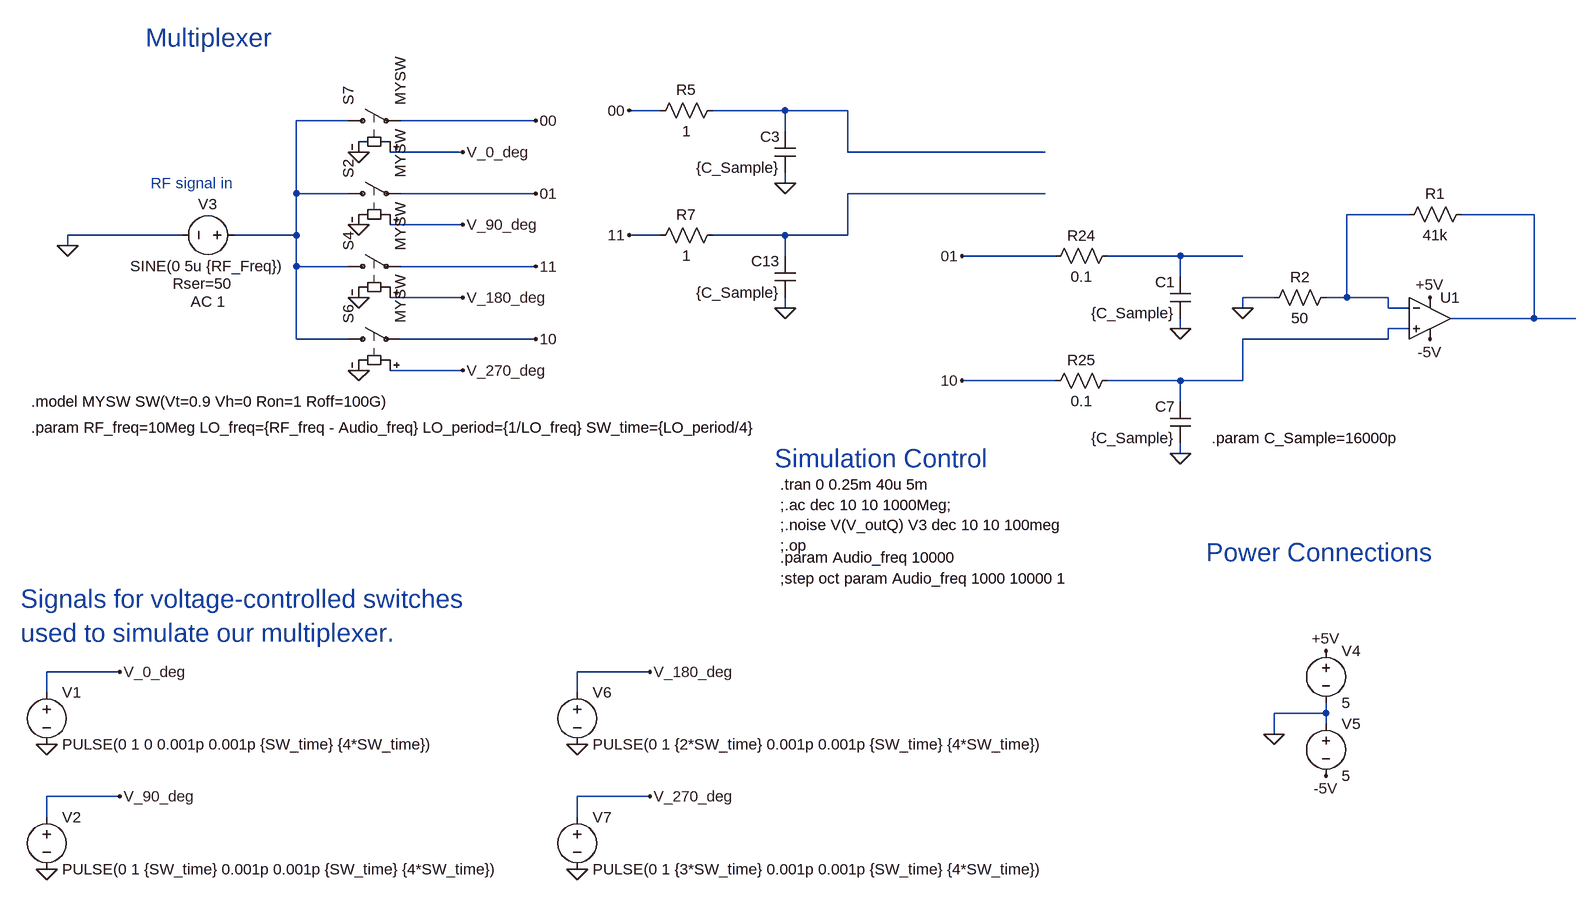
[diagram p0: schematic TayloeDetectorNonInvertingOnly.asc]
TayloeDetectorNonInvertingOnly.asc, the LTspice schematic file:
Version 4
SHEET 1 3200 1748
WIRE 208 -64 160 -64
WIRE 400 -64 288 -64
WIRE 496 -64 400 -64
WIRE -272 -48 -352 -48
WIRE 16 -48 -192 -48
WIRE 400 -32 400 -64
WIRE -96 0 -208 0
WIRE 496 0 496 -64
WIRE 800 0 496 0
WIRE 400 48 400 32
WIRE -352 64 -352 -48
WIRE -272 64 -352 64
WIRE 16 64 -192 64
WIRE 800 64 496 64
WIRE 1360 96 1264 96
WIRE 1552 96 1440 96
WIRE -96 112 -208 112
WIRE -528 128 -704 128
WIRE -352 128 -352 64
WIRE -352 128 -448 128
WIRE 208 128 160 128
WIRE 400 128 288 128
WIRE 496 128 496 64
WIRE 496 128 400 128
WIRE -704 144 -704 128
WIRE 400 160 400 128
WIRE 816 160 672 160
WIRE 1008 160 896 160
WIRE 1104 160 1008 160
WIRE -352 176 -352 128
WIRE -272 176 -352 176
WIRE 16 176 -192 176
WIRE 1008 192 1008 160
WIRE -96 224 -208 224
WIRE 1152 224 1104 224
WIRE 1264 224 1264 96
WIRE 1264 224 1232 224
WIRE 1328 224 1264 224
WIRE 400 240 400 224
WIRE 1104 240 1104 224
WIRE 1328 240 1328 224
WIRE 1360 240 1328 240
WIRE 1552 256 1552 96
WIRE 1552 256 1424 256
WIRE 1616 256 1552 256
WIRE 1008 272 1008 256
WIRE 1360 272 1328 272
WIRE -352 288 -352 176
WIRE -272 288 -352 288
WIRE 16 288 -192 288
WIRE 1328 288 1328 272
WIRE 1328 288 1104 288
WIRE -96 336 -208 336
WIRE 816 352 672 352
WIRE 1008 352 896 352
WIRE 1104 352 1104 288
WIRE 1104 352 1008 352
WIRE 1008 384 1008 352
WIRE 1008 464 1008 448
WIRE -624 800 -736 800
WIRE 192 800 80 800
WIRE -736 832 -736 800
WIRE 80 832 80 800
WIRE 1232 864 1232 848
WIRE 1232 864 1152 864
WIRE 1232 880 1232 864
WIRE 1152 896 1152 864
WIRE -624 992 -736 992
WIRE 192 992 80 992
WIRE -736 1024 -736 992
WIRE 80 1024 80 992
FLAG -256 0 0
FLAG -256 112 0
FLAG -256 224 0
FLAG -256 336 0
FLAG -704 144 0
FLAG 1232 768 +5V
FLAG 1152 896 0
FLAG 1232 960 -5V
FLAG -96 0 V_0_deg
FLAG -96 112 V_90_deg
FLAG -96 224 V_180_deg
FLAG -96 336 V_270_deg
FLAG -736 912 0
FLAG -624 800 V_0_deg
FLAG -736 1104 0
FLAG -624 992 V_90_deg
FLAG 80 912 0
FLAG 192 800 V_180_deg
FLAG 80 1104 0
FLAG 192 992 V_270_deg
FLAG 16 -48 00
FLAG 16 176 11
FLAG 1008 464 0
FLAG 1008 272 0
FLAG 16 64 01
FLAG 16 288 10
FLAG 400 240 0
FLAG 400 48 0
FLAG 160 128 11
FLAG 160 -64 00
FLAG 672 352 10
FLAG 672 160 01
FLAG 1392 224 +5V
FLAG 1392 288 -5V
FLAG 1104 240 0
SYMBOL sw -288 -48 R270
SYMATTR InstName S7
SYMATTR Value MYSW
SYMBOL sw -288 64 R270
SYMATTR InstName S2
SYMATTR Value MYSW
SYMBOL sw -288 176 R270
SYMATTR InstName S4
SYMATTR Value MYSW
SYMBOL sw -288 288 R270
SYMATTR InstName S6
SYMATTR Value MYSW
SYMBOL voltage -432 128 R90
WINDOW 0 -32 56 VBottom 2
WINDOW 3 32 56 VTop 2
WINDOW 123 118 56 VBottom 2
WINDOW 39 90 64 VBottom 2
SYMATTR InstName V3
SYMATTR Value SINE(0 5u {RF_Freq})
SYMATTR Value2 AC 1
SYMATTR SpiceLine Rser=50
SYMBOL voltage 1232 752 R0
WINDOW 123 0 0 Left 0
WINDOW 39 0 0 Left 0
SYMATTR InstName V4
SYMATTR Value 5
SYMBOL voltage 1232 864 R0
WINDOW 123 0 0 Left 0
WINDOW 39 0 0 Left 0
SYMATTR InstName V5
SYMATTR Value 5
SYMBOL voltage -736 816 R0
WINDOW 123 0 0 Left 0
WINDOW 39 0 0 Left 0
SYMATTR InstName V1
SYMATTR Value PULSE(0 1 0 0.001p 0.001p {SW_time} {4*SW_time})
SYMBOL voltage -736 1008 R0
WINDOW 123 0 0 Left 0
WINDOW 39 0 0 Left 0
SYMATTR InstName V2
SYMATTR Value PULSE(0 1 {SW_time} 0.001p 0.001p {SW_time} {4*SW_time})
SYMBOL voltage 80 816 R0
WINDOW 123 0 0 Left 0
WINDOW 39 0 0 Left 0
SYMATTR InstName V6
SYMATTR Value PULSE(0 1 {2*SW_time} 0.001p 0.001p {SW_time} {4*SW_time})
SYMBOL voltage 80 1008 R0
WINDOW 123 0 0 Left 0
WINDOW 39 0 0 Left 0
SYMATTR InstName V7
SYMATTR Value PULSE(0 1 {3*SW_time} 0.001p 0.001p {SW_time} {4*SW_time})
SYMBOL cap 1024 256 R180
WINDOW 0 24 56 Left 2
WINDOW 3 24 8 Left 2
SYMATTR InstName C1
SYMATTR Value {C_Sample}
SYMBOL cap 1024 448 R180
WINDOW 0 24 56 Left 2
WINDOW 3 24 8 Left 2
SYMATTR InstName C7
SYMATTR Value {C_Sample}
SYMBOL res 912 144 R90
WINDOW 0 0 56 VBottom 2
WINDOW 3 32 56 VTop 2
SYMATTR InstName R24
SYMATTR Value 0.1
SYMBOL res 912 336 R90
WINDOW 0 0 56 VBottom 2
WINDOW 3 32 56 VTop 2
SYMATTR InstName R25
SYMATTR Value 0.1
SYMBOL cap 416 32 R180
WINDOW 0 24 56 Left 2
WINDOW 3 24 8 Left 2
SYMATTR InstName C3
SYMATTR Value {C_Sample}
SYMBOL cap 416 224 R180
WINDOW 0 24 56 Left 2
WINDOW 3 24 8 Left 2
SYMATTR InstName C13
SYMATTR Value {C_Sample}
SYMBOL res 304 -80 R90
WINDOW 0 0 56 VBottom 2
WINDOW 3 32 56 VTop 2
SYMATTR InstName R5
SYMATTR Value 1
SYMBOL res 304 112 R90
WINDOW 0 0 56 VBottom 2
WINDOW 3 32 56 VTop 2
SYMATTR InstName R7
SYMATTR Value 1
SYMBOL res 1456 80 R90
WINDOW 0 0 56 VBottom 2
WINDOW 3 32 56 VTop 2
SYMATTR InstName R1
SYMATTR Value 41k
SYMBOL Opamps\\UniversalOpamp2 1392 256 R0
SYMATTR InstName U1
SYMATTR SpiceModel level.1
SYMATTR Value2 Avol=1Meg GBW=100Meg Slew=100Meg
SYMBOL res 1248 208 R90
WINDOW 0 0 56 VBottom 2
WINDOW 3 32 56 VTop 2
SYMATTR InstName R2
SYMATTR Value 50
TEXT -760 384 Left 2 !.model MYSW SW(Vt=0.9 Vh=0 Ron=1 Roff=100G)
TEXT 392 512 Left 2 !.tran 0 0.25m 40u 5m\n;.ac dec 10 10 1000Meg;\n;.noise V(V_outQ) V3 dec 10 10 100meg\n;.op
TEXT -760 424 Left 2 !.param RF_freq=10Meg LO_freq={RF_freq - Audio_freq} LO_period={1/LO_freq} SW_time={LO_period/4}
TEXT 1056 440 Left 2 !.param C_Sample=16000p
TEXT -776 688 Left 4 ;Signals for voltage-controlled switches \nused to simulate our multiplexer.
TEXT 1048 616 Left 4 ;Power Connections
TEXT -576 48 Left 2 ;RF signal in
TEXT -584 -176 Left 4 ;Multiplexer
TEXT 384 472 Left 4 ;Simulation Control
TEXT 392 656 Left 2 !;step oct param Audio_freq 1000 10000 1
TEXT 392 624 Left 2 !.param Audio_freq 10000

The netlist it stands for:
* TayloeDetectorNonInvertingOnly.asc
S7 N002 00 V_0_deg 0 MYSW
S2 N002 01 V_90_deg 0 MYSW
S4 N002 11 V_180_deg 0 MYSW
S6 N002 10 V_270_deg 0 MYSW
V3 N002 0 SINE(0 5u {RF_Freq}) AC 1 Rser=50
V4 +5V 0 5
V5 0 -5V 5
V1 V_0_deg 0 PULSE(0 1 0 0.001p 0.001p {SW_time} {4*SW_time})
V2 V_90_deg 0 PULSE(0 1 {SW_time} 0.001p 0.001p {SW_time} {4*SW_time})
V6 V_180_deg 0 PULSE(0 1 {2*SW_time} 0.001p 0.001p {SW_time} {4*SW_time})
V7 V_270_deg 0 PULSE(0 1 {3*SW_time} 0.001p 0.001p {SW_time} {4*SW_time})
C1 0 N006 {C_Sample}
C7 0 N007 {C_Sample}
R24 N006 01 0.1
R25 N007 10 0.1
C3 0 N001 {C_Sample}
C13 0 N003 {C_Sample}
R5 N001 00 1
R7 N003 11 1
R1 N005 N004 41k
XU1 N007 N004 +5V -5V N005 level.1 Avol=1Meg GBW=100Meg Slew=100Meg ilimit=25m rail=0 Vos=0 phimargin=45 en=0 enk=0 in=0 ink=0 Rin=500Meg  ; pins IN+ IN- V+ V- OUT
R2 N004 0 50
.model MYSW SW(Vt=0.9 Vh=0 Ron=1 Roff=100G)
.tran 0 0.25m 40u 5m
;.ac dec 10 10 1000Meg;
;.noise V(V_outQ) V3 dec 10 10 100meg
;.op
.param RF_freq=10Meg LO_freq={RF_freq - Audio_freq} LO_period={1/LO_freq} SW_time={LO_period/4}
.param C_Sample=16000p
* Signals for voltage-controlled switches
* used to simulate our multiplexer.
* Power Connections
* RF signal in
* Multiplexer
* Simulation Control
;step oct param Audio_freq 1000 10000 1
.param Audio_freq 10000
.lib UniversalOpamps2.sub
.backanno
.end